# Altium schematic sheet BATTERY PACK.SchDoc
size A3; DocumentNumber: 1; SheetNumber: 3; SheetTotal: 2
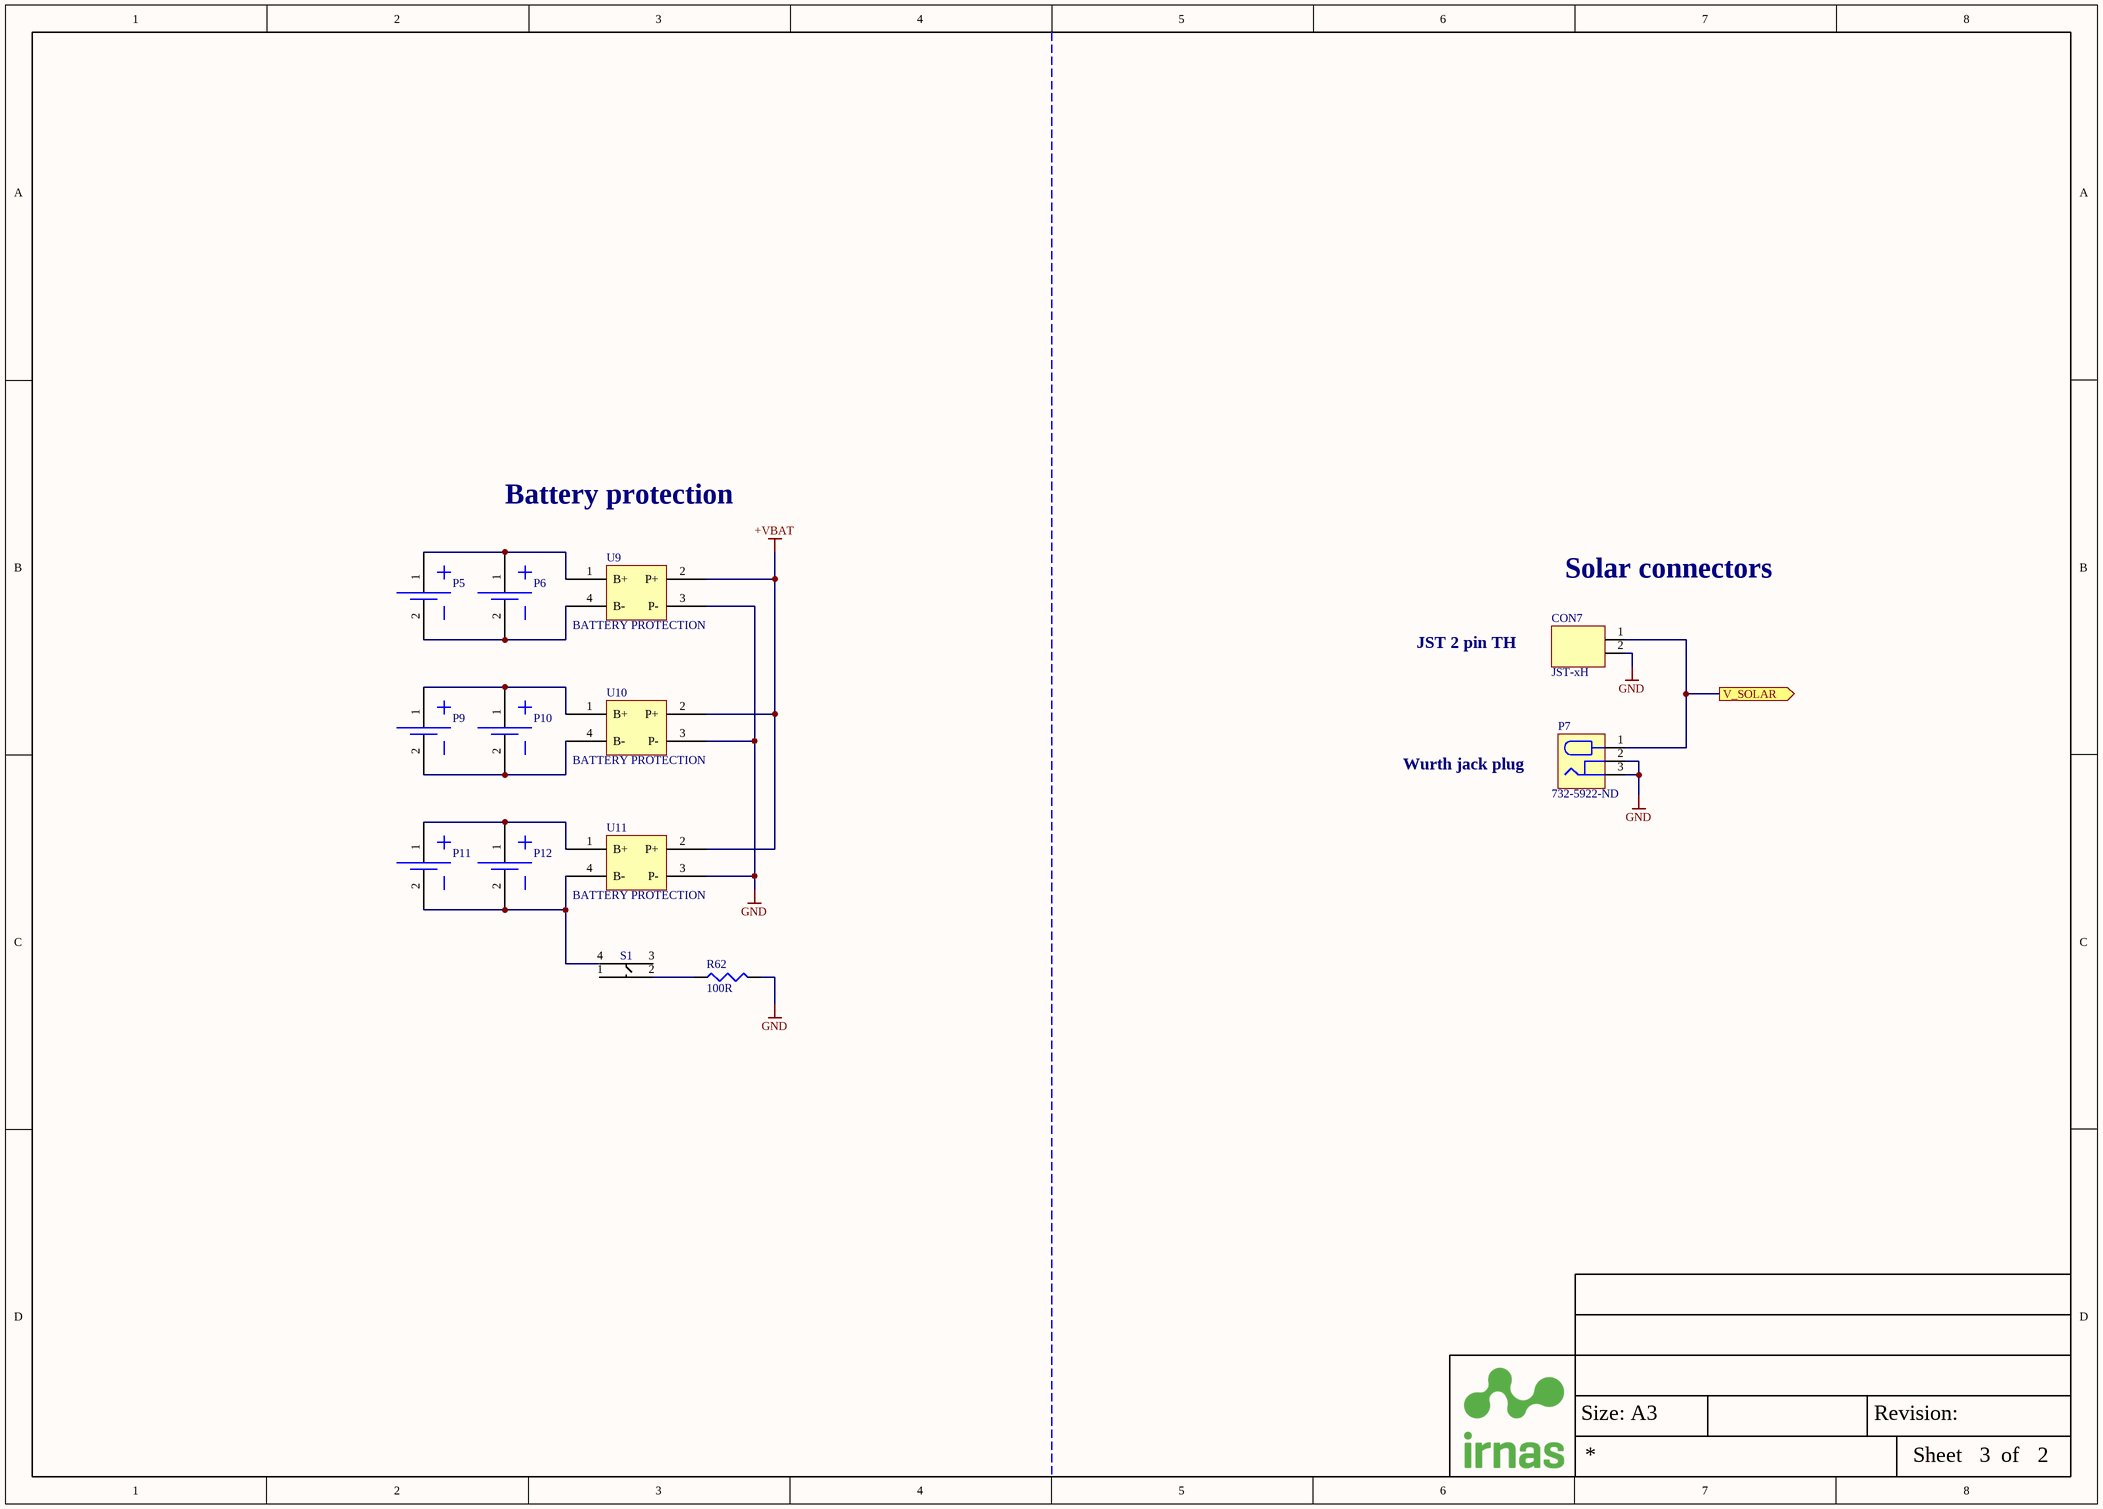
[diagram p0: BATTERY PACK.SchDoc]

## Parts
CON7  JST-xH  [JST_2PIN_TH]
P5  BAT - 18650  [BATTERY HOLDER 18650]  (value not drawn)
P6  BAT - 18650  [BATTERY HOLDER 18650]  (value not drawn)
P7  732-5922-ND  [732-5922-ND]
P9  BAT - 18650  [BATTERY HOLDER 18650]  (value not drawn)
P10  BAT - 18650  [BATTERY HOLDER 18650]  (value not drawn)
P11  BAT - 18650  [BATTERY HOLDER 18650]  (value not drawn)
P12  BAT - 18650  [BATTERY HOLDER 18650]  (value not drawn)
R62  100R  [RES0603]
S1  BTN - KMR221NGLFS  [SW]  (value not drawn)
U9  BATTERY PROTECTION  [BATTERY PROTECTION]
U10  BATTERY PROTECTION  [BATTERY PROTECTION]
U11  BATTERY PROTECTION  [BATTERY PROTECTION]

## Ports
V_SOLAR (out)

## Nets
+VBAT: U9.2(P+) U10.2(P+) U11.2(P+)
GND: CON7.2 P7.2 P7.3 R62.2 U9.3(P-) U10.3(P-) U11.3(P-)
V_SOLAR: CON7.1 P7.1 ; port V_SOLAR
NetP5_1: P5.1 P6.1 U9.1(B+)
NetP5_2: P5.2 P6.2 U9.4(B-)
NetP9_1: P9.1 P10.1 U10.1(B+)
NetP9_2: P9.2 P10.2 U10.4(B-)
NetP11_1: P11.1 P12.1 U11.1(B+)
NetP11_2: P11.2 P12.2 S1.4 U11.4(B-)
NetR62_1: R62.1 S1.2

Not connected (* = marked no-connect by the designer): S1 1 3

## Notes on the sheet
- Battery protection
- Solar connectors
- JST 2 pin TH
- Wurth jack plug
- Size: A3
- Revision:
- Sheet
- of

## Library data of the parts
CON7 = B2B-XH-A (LF)(SN): Wire-To-Board Connector, Vertical, 2.5 mm, 2 Contacts, Header, XH Series, Through Hole, 1 Rows; ComponentLink1Description: Datasheet; ComponentLink1URL: http://www.farnell.com/datasheets/2057209.pdf?_ga=2.26100990.2144023421.1568612611-1741076818.1563951383; Supplier 1: Farnell; Supplier Part Number 1: 1516276
P5 P6 P9-P12 = BAT - 18650: BATERRY HOLDER 18650; Supplier Part Number 1: Battery holder for 18650
P7 = CONN PWR JACK 1.05X3.5MM: Power Barrel Connector Jack 1.05mm ID (0.041"), 3.50mm OD (0.138") Through Hole, Right Angle; ComponentLink1Description: Datasheet; ComponentLink1URL: https://katalog.we-online.de/em/datasheet/6941xx303002.pdf; Supplier 1: Farnell; Supplier Part Number 1: 2472141
R62 = R - 100R: MULTICOMP - MC0063W06031100R - RES, THICK FILM, 100R, 1%, 0.063W, 0603; IRNAS Part No.: I-100009; Resistance: 100; Voltage Rating: 50; Resistor Case Style: 0603 [1608 Metric]; Power Rating: 63; Product Range: MC Series; Temperature Coefficient: ± 200; SVHC: No SVHC (12-Jan-2017); External Depth: 0.45; External Length / Height: 1.6; External Width: 0.8; No. of Pins: 2; Reel Quantity: 5000; Resistor Mounting: Surface Mount Device; Temperature Coeff. +: 200; Voltage Rating V DC: 50V<!--FANDB--><div class="features-and-benefits-container"><div class="features-and-benefits-description"><span class="features-benefits-value">The Multicomp MC series current sense resistors are thick film chip resistors. The resistance range includes E96 and E24 decade values from 1ohm to 10Mohm.</span></div><div class="features-and-benefits-list"><ul class="features-and-benefits-list-list"><li class="features-and-benefits-list-item">EIA 0402, 0603, 0805, 1206 chip sizes available</li><li class="features-and-benefits-list-item">Small size and low weight</li><li class="features-and-benefits-list-item">Suitable for both wave and reflow soldering</li><li class="features-and-benefits-list-item">Reduction of assembly costs</li><li class="features-and-benefits-list-item">Maximum working voltage of 50V(0402, 0603), 150V(0805), 200V(1206)</li><li class="features-and-benefits-list-item">Available in ±1%, ±2% and ±5% tolerance</li><li class="features-and-benefits-list-item">Power rating of 62.5mW, 100mW and 125mW</li><li class="features-and-benefits-list-item">±400ppm/°C(1ohm to 10ohm), ±200ppm/°C(11ohm to 100ohm), ±100; Supplier 1: Farnell; Manufacturer: MULTICOMP; Manufacturer Part Number: MC0063W06031100R; RoHS: Y-EX; Stock 1: 78152; Pricing 1: 10=0.0011, 100=0.001, 500=0.0009, 1000=0.0008, 2500=0.0007 (GBP); Resistance Tolerance: ± 1%; Packaging: Cut Tape; Resistor Element Material: Thick Film; Automotive Qualification Standard: -; Operating Temperature Max: 155; Operating Temperature Min: -55; Operating Temperature Range: -55°C to +155; Tape Width: 8; Temperature Coeff. -: 200; Tolerance +: 1%; Tolerance -: 1%; ComponentLink1URL: http://www.farnell.com/datasheets/1788326.pdf; ComponentLink1Description: http://www.farnell.com/datasheets/1788326.pdf; ComponentLink2URL: http://www.farnell.com/cad/1561149.zip; ComponentLink2Description: http://www.farnell.com/cad/1561149.zip; ComponentLink3URL: http://www.farnell.com/datasheets/2289252.pdf; ComponentLink3Description: http://www.farnell.com/datasheets/2289252.pdf; Supplier Part Number 1: 9330364
S1 = BTN - KMR221NGLFS: SWITCH TACTILE SPST-NO 0.05A 32V; Manufacturer: ITT C&K; Mechanical Life: 200000Cycles; Throw Configuration: SPST; Operating Force: 2N; Max Current Rating: 50mA; Power Rating: 1W; Illumination Type: Non-Illuminated; Switch Travel: 0.25mm; Switch Function: Off-Mom; Actuator Type: Standard; Actuator Length: 0.5mm; Supplier 1: Farnell; Manufacturer Part Number: KMR221NGLFS; Stock 1: 3038; Pricing 1: 10 = 0.29100, 500 = 0.27600, 1000 = 0.21800, 5000 = 0.18500, 10000 = 0.18100 (GBP); RoHS: Yes; Mount: Surface Mount; Case/Package: SMD/SMT; Contact Material: Silver; Contact Plating: Silver; Min Operating Temperature: -40°C; Max Operating Temperature: 85°C; Voltage Rating (DC): 32V; Packaging: Tape and Reel; Package Quantity: 1; Max Voltage Rating (DC): 32V; Current Rating: 50mA; Termination: Gull Wing; Orientation: Straight; Length: 2.8mm; Depth: 4.6mm; Radiation Hardening: No; Lead Free: Lead Free; ComponentLink1URL: https://www.ckswitches.com/media/1479/kmr2.pdf?src-supplier=Digi-Key; ComponentLink1Description: https://www.ckswitches.com/media/1479/kmr2.pdf?src-supplier=Digi-Key; ComponentLink2URL: http://www.ck-components.com/14414/kmr2_9aug12.pdf/?src-supplier=Avnet+Europe; ComponentLink2Description: http://www.ck-components.com/14414/kmr2_9aug12.pdf/?src-supplier=Avnet+Europe; ComponentLink3URL: http://www1.futureelectronics.com/doc/C%20-%20K%20COMPONENTS/KMR221NGLFS.pdf?src-supplier=Future+Electronics; ComponentLink3Description: http://www1.futureelectronics.com/doc/C%20-%20K%20COMPONENTS/KMR221NGLFS.pdf?src-supplier=Future+Electronics; Supplier Part Number 1: 2845727
U9-U11 = BATTERY PROTECTION: Supplier Part Number 1: Battery protection